# EAGLE design connce (EAGLE 6.3)
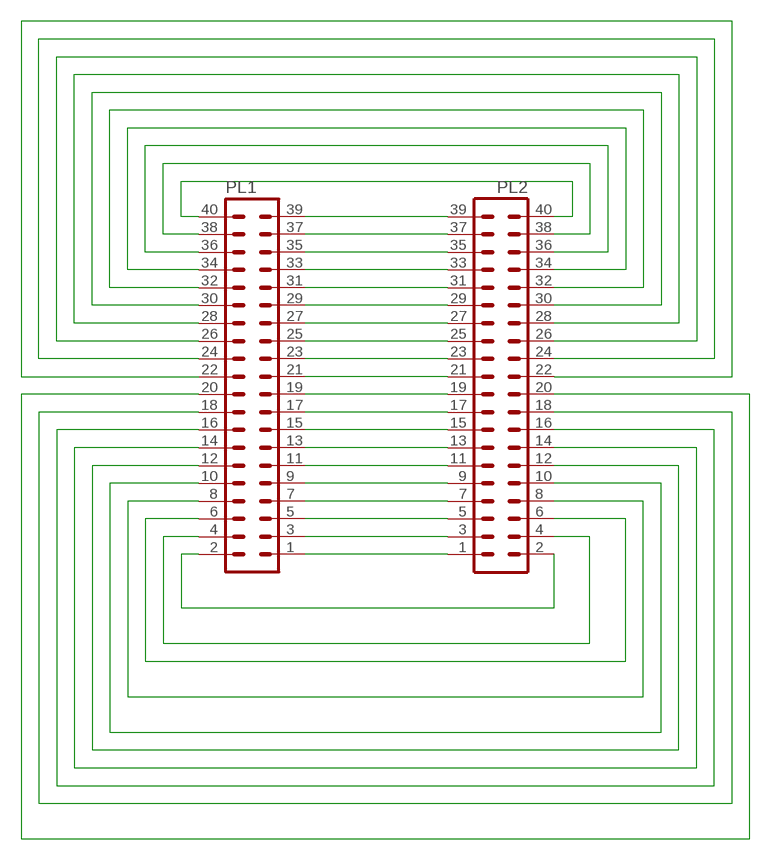
[diagram p0: schematic, sheet 1]

## Parts
PL1  40V  [40V]
PL2  40V  [40V]

## Nets
N$1: PL1.1 PL2.1
N$2: PL1.3 PL2.3
N$3: PL1.5 PL2.5
N$4: PL1.7 PL2.7
N$5: PL1.9 PL2.9
N$6: PL1.11 PL2.11
N$7: PL1.13 PL2.13
N$8: PL1.15 PL2.15
N$9: PL1.17 PL2.17
N$10: PL1.19 PL2.19
N$11: PL1.21 PL2.21
N$12: PL1.23 PL2.23
N$13: PL1.25 PL2.25
N$14: PL1.27 PL2.27
N$15: PL1.29 PL2.29
N$16: PL1.31 PL2.31
N$17: PL1.33 PL2.33
N$18: PL1.35 PL2.35
N$19: PL1.37 PL2.37
N$20: PL1.39 PL2.39
N$21: PL1.2 PL2.2
N$22: PL1.4 PL2.4
N$23: PL1.6 PL2.6
N$24: PL1.8 PL2.8
N$25: PL1.10 PL2.10
N$26: PL1.12 PL2.12
N$27: PL1.14 PL2.14
N$28: PL1.16 PL2.16
N$29: PL1.18 PL2.18
N$30: PL1.20 PL2.20
N$31: PL1.40 PL2.40
N$32: PL1.38 PL2.38
N$33: PL1.36 PL2.36
N$34: PL1.34 PL2.34
N$35: PL1.32 PL2.32
N$36: PL1.30 PL2.30
N$37: PL1.28 PL2.28
N$38: PL1.26 PL2.26
N$39: PL1.24 PL2.24
N$40: PL1.22 PL2.22

## Library data of the parts
PL1 PL2 = con-harting-v:40V: CONNECTOR; OC_FARNELL: unknown; OC_NEWARK: unknown

## Board
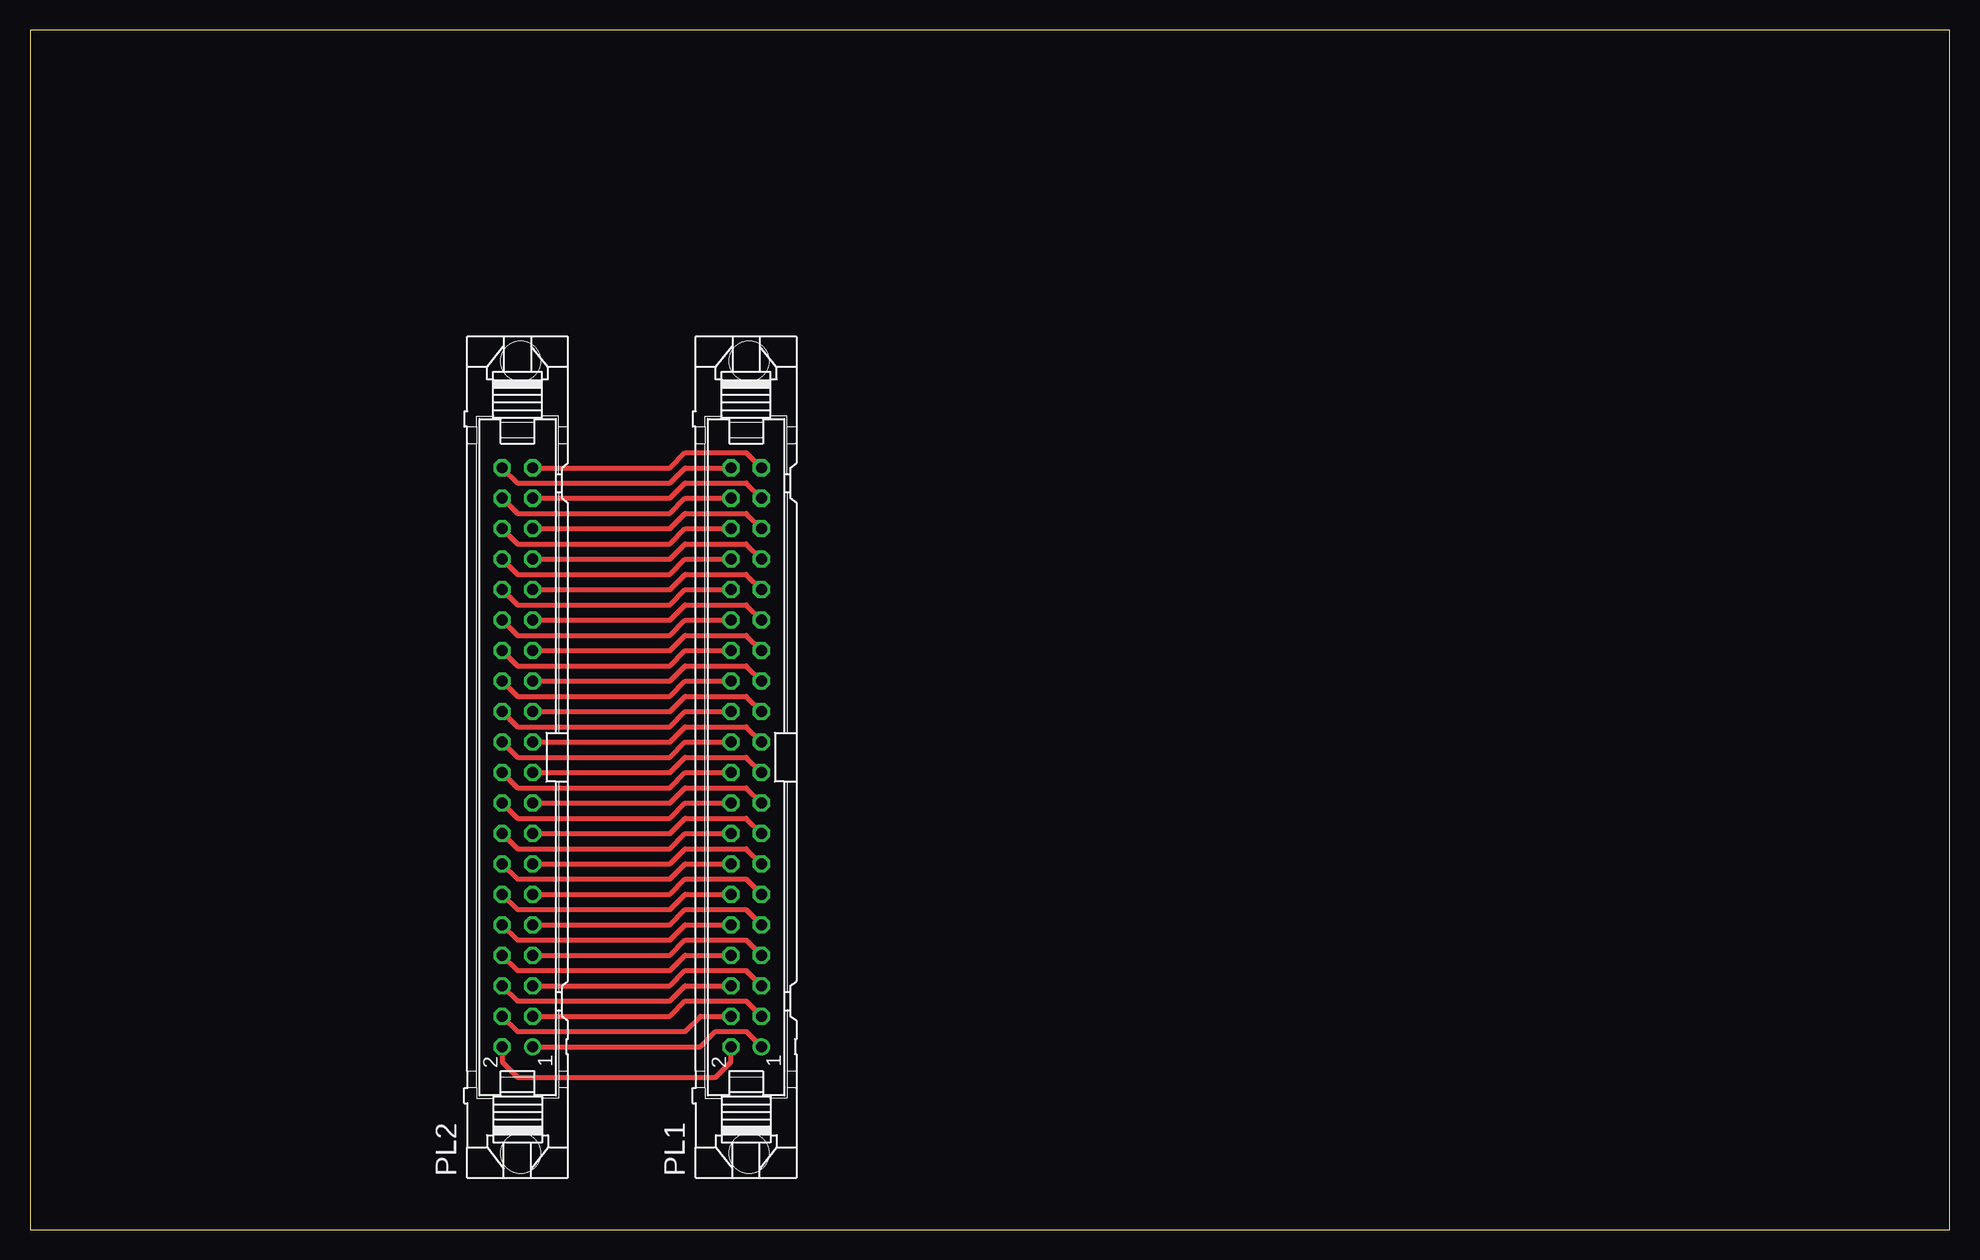
[diagram p1: board, top side]

Size 160 x 100 mm. Coordinates in mm from the lower left corner, seen from the top.
Outline: 0,0 160,0 160,100 0,100 0,0
Copper layers (1*16): Top 0.035mm / dielectric 1.5mm / Bottom 0.035mm
Design rules "default": minimum track width 10mil, minimum drill 24mil, track to track 8mil, track to pad 8mil, pad to pad 8mil, via to via 8mil, smd to smd 8mil, copper to edge 40mil, drill to drill 8mil, minimum pad ring 10mil, minimum via ring 8mil, stop-mask expansion 4mil, vias tented up to drill 0mil, thermal gap 10mil

### Footprints (pad centres in the part's own frame; a part is rotated, then mirrored left to right if it is on the bottom)
40V = drill 0.914: 1 -24.13,-1.27 | drill 0.914 octagon: 2 -24.13,1.27; 3 -21.59,-1.27; 4 -21.59,1.27; 5 -19.05,-1.27; 6 -19.05,1.27; 7 -16.51,-1.27; 8 -16.51,1.27; 9 -13.97,-1.27; 10 -13.97,1.27; 11 -11.43,-1.27; 12 -11.43,1.27; 13 -8.89,-1.27; 14 -8.89,1.27; 15 -6.35,-1.27; 16 -6.35,1.27; 17 -3.81,-1.27; 18 -3.81,1.27; 19 -1.27,-1.27; 20 -1.27,1.27; 21 1.27,-1.27; 22 1.27,1.27; 23 3.81,-1.27; 24 3.81,1.27; 25 6.35,-1.27; 26 6.35,1.27; 27 8.89,-1.27; 28 8.89,1.27; 29 11.43,-1.27; 30 11.43,1.27; 31 13.97,-1.27; 32 13.97,1.27; 33 16.51,-1.27; 34 16.51,1.27; 35 19.05,-1.27; 36 19.05,1.27; 37 21.59,-1.27; 38 21.59,1.27; 39 24.13,-1.27; 40 24.13,1.27 | hole 3.302: 33.02,-0.254; -33.02,-0.254

### Placement (x,y rotation side)
PL1  59.69,39.37 90 top
PL2  40.64,39.37 90 top

### Tracks (layer width: path | path; a pad name or v marks a point on that pad's centre or on a via)
N$1
  Top 0.406: PL2.1 55.88,15.24 57.15,16.51 59.69,16.51 PL1.1
N$2
  Top 0.406: PL2.3 53.34,17.78 54.61,19.05 59.69,19.05 PL1.3
N$3
  Top 0.406: PL2.5 53.34,20.32 54.61,21.59 59.69,21.59 PL1.5
N$4
  Top 0.406: PL2.7 53.34,22.86 54.61,24.13 59.69,24.13 PL1.7
N$5
  Top 0.406: PL2.9 53.34,25.4 54.61,26.67 59.69,26.67 PL1.9
N$6
  Top 0.406: PL2.11 53.34,27.94 54.61,29.21 59.69,29.21 PL1.11
N$7
  Top 0.406: PL2.13 53.34,30.48 54.61,31.75 59.69,31.75 PL1.13
N$8
  Top 0.406: PL2.15 53.34,33.02 54.61,34.29 59.69,34.29 PL1.15
N$9
  Top 0.406: PL2.17 53.34,35.56 54.61,36.83 59.69,36.83 PL1.17
N$10
  Top 0.406: PL2.19 53.34,38.1 54.61,39.37 59.69,39.37 PL1.19
N$11
  Top 0.406: PL2.21 53.34,40.64 54.61,41.91 59.69,41.91 PL1.21
N$12
  Top 0.406: PL2.23 53.34,43.18 54.61,44.45 59.69,44.45 PL1.23
N$13
  Top 0.406: PL2.25 53.34,45.72 54.61,46.99 59.69,46.99 PL1.25
N$14
  Top 0.406: PL2.27 53.34,48.26 54.61,49.53 59.69,49.53 PL1.27
N$15
  Top 0.406: PL2.29 53.34,50.8 54.61,52.07 59.69,52.07 PL1.29
N$16
  Top 0.406: PL2.31 53.34,53.34 54.61,54.61 59.69,54.61 PL1.31
N$17
  Top 0.406: PL2.33 53.34,55.88 54.61,57.15 59.69,57.15 PL1.33
N$18
  Top 0.406: PL2.35 53.34,58.42 54.61,59.69 59.69,59.69 PL1.35
N$19
  Top 0.406: PL2.37 53.34,60.96 54.61,62.23 59.69,62.23 PL1.37
N$20
  Top 0.406: PL2.39 53.34,63.5 54.61,64.77 59.69,64.77 PL1.39
N$21
  Top 0.406: PL2.2 39.37,13.97 40.64,12.7 57.15,12.7 58.42,13.97 PL1.2
N$22
  Top 0.406: PL2.4 40.64,16.51 54.61,16.51 55.88,17.78 PL1.4
N$23
  Top 0.406: PL2.6 40.64,19.05 53.34,19.05 54.61,20.32 PL1.6
N$24
  Top 0.406: PL2.8 40.64,21.59 53.34,21.59 54.61,22.86 PL1.8
N$25
  Top 0.406: PL2.10 40.64,24.13 53.34,24.13 54.61,25.4 PL1.10
N$26
  Top 0.406: PL2.12 40.64,26.67 53.34,26.67 54.61,27.94 PL1.12
N$27
  Top 0.406: PL2.14 40.64,29.21 53.34,29.21 54.61,30.48 PL1.14
N$28
  Top 0.406: PL2.16 40.64,31.75 53.34,31.75 54.61,33.02 PL1.16
N$29
  Top 0.406: PL2.18 40.64,34.29 53.34,34.29 54.61,35.56 PL1.18
N$30
  Top 0.406: PL2.20 40.64,36.83 53.34,36.83 54.61,38.1 PL1.20
N$31
  Top 0.406: PL2.40 40.64,62.23 53.34,62.23 54.61,63.5 PL1.40
N$32
  Top 0.406: PL2.38 40.64,59.69 53.34,59.69 54.61,60.96 PL1.38
N$33
  Top 0.406: PL2.36 40.64,57.15 53.34,57.15 54.61,58.42 PL1.36
N$34
  Top 0.406: PL2.34 40.64,54.61 53.34,54.61 54.61,55.88 PL1.34
N$35
  Top 0.406: PL2.32 40.64,52.07 53.34,52.07 54.61,53.34 PL1.32
N$36
  Top 0.406: PL2.30 40.64,49.53 53.34,49.53 54.61,50.8 PL1.30
N$37
  Top 0.406: PL2.28 40.64,46.99 53.34,46.99 54.61,48.26 PL1.28
N$38
  Top 0.406: PL2.26 40.64,44.45 53.34,44.45 54.61,45.72 PL1.26
N$39
  Top 0.406: PL2.24 40.64,41.91 53.34,41.91 54.61,43.18 PL1.24
N$40
  Top 0.406: PL2.22 40.64,39.37 53.34,39.37 54.61,40.64 PL1.22